# EAGLE design dallamcsengő (EAGLE 9.0.0)
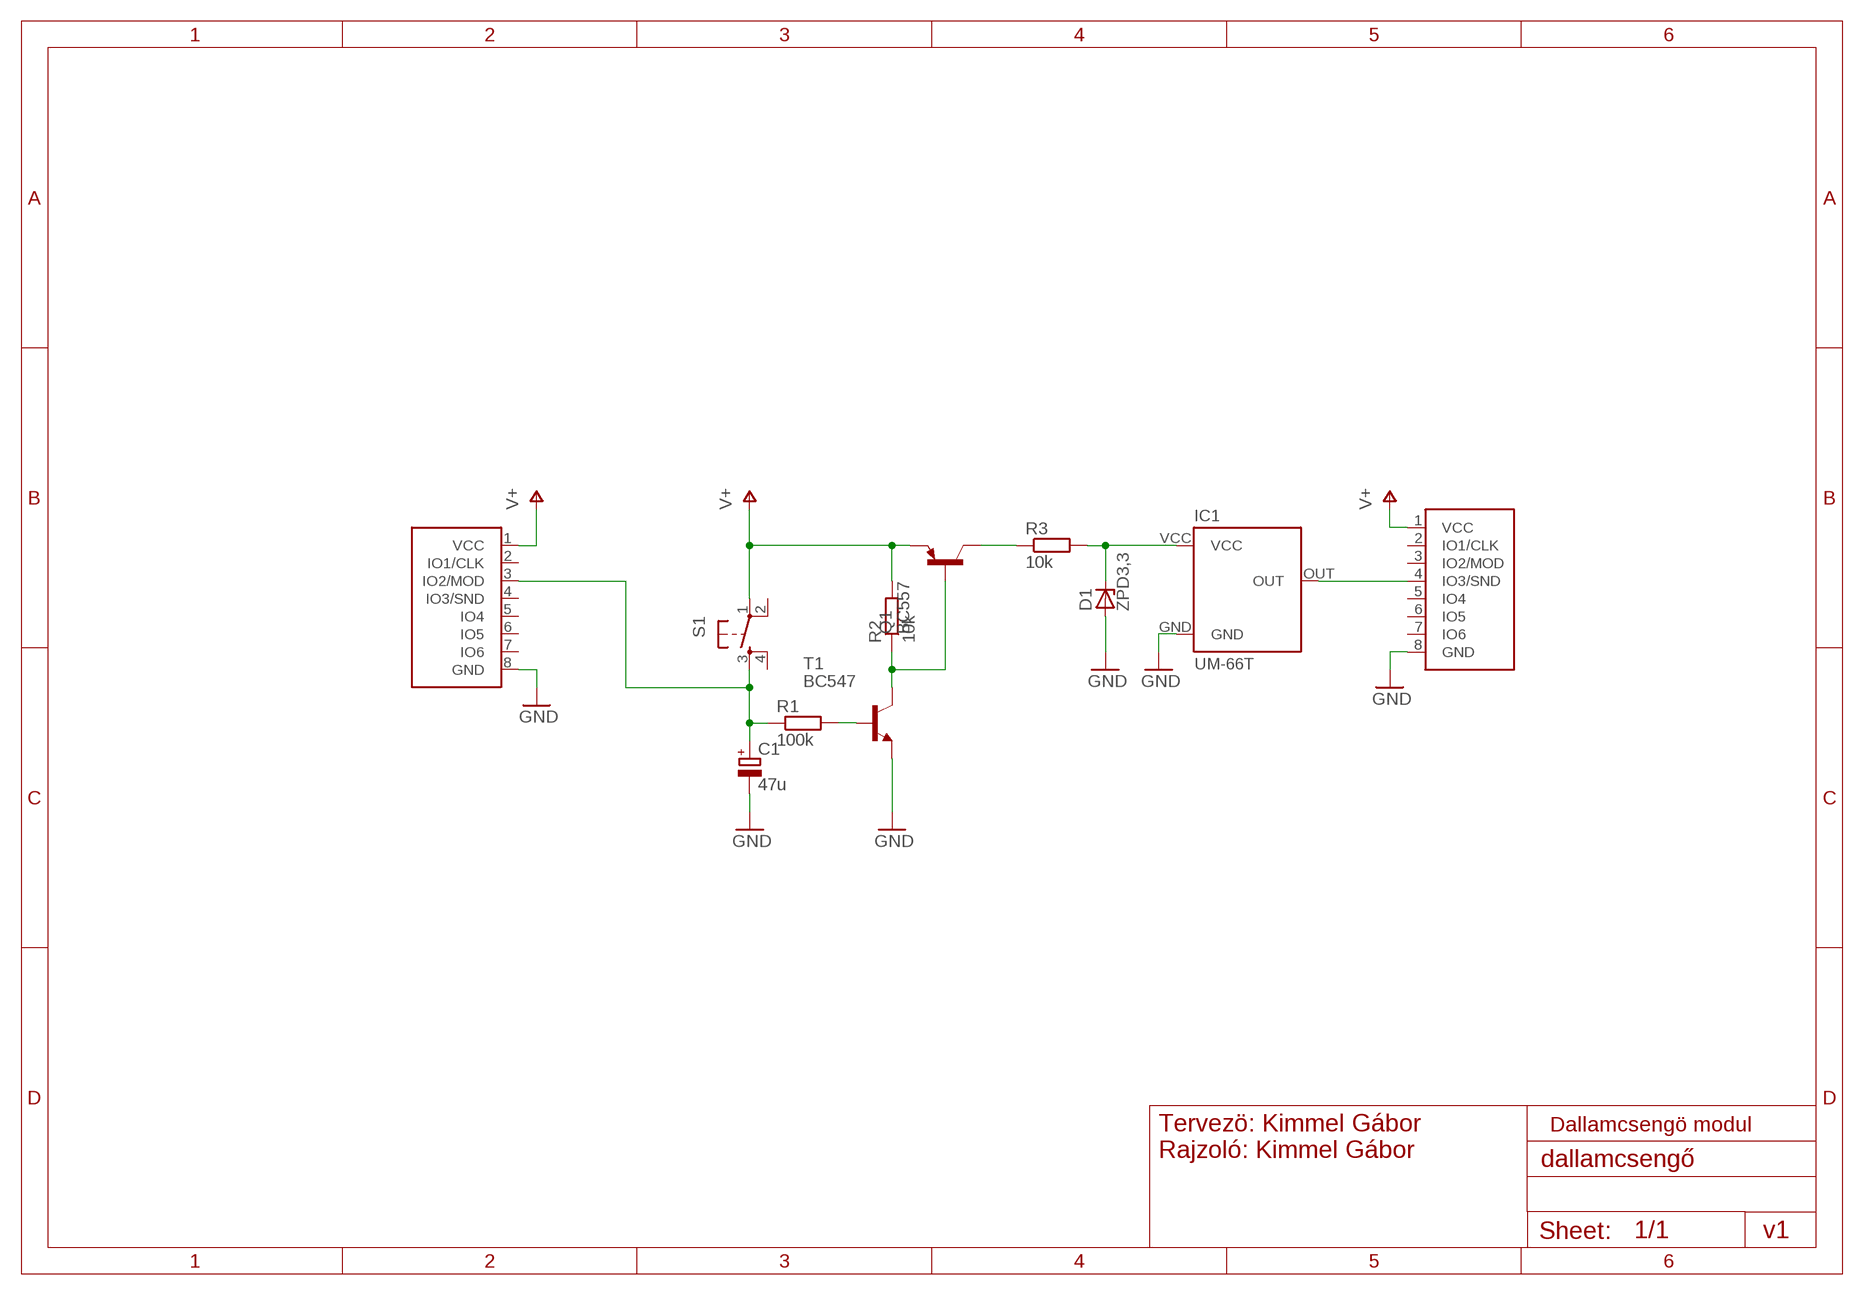
[diagram p0: schematic, sheet 1]

## Parts
C1  47u  CPOL-EUE5-8.5  [E5-8,5]
D1  ZPD3,3  ZENER-DIODEDO35Z10  [DO35Z10]
IC1  UM-66T  [TO92-DCS]
Q1  BC557  [TO92]
R1  100k  R-EU_0309/12  [0309/12]
R2  10k  R-EU_0309/12  [0309/12]
R3  10k  R-EU_0309/12  [0309/12]
S1  TAC_SWITCHPTH  [TACTILE-PTH]
T1  BC547  [TO92]
U$1  GANZ-CONNECTOR  [FE08W]
U$2  GANZ-CONNECTOR-OUT  [MA08-1W]

## Nets
GND: C1.- D1.A IC1.GND T1.1(E) U$1.8(GND) U$2.8(GND)
N$1: C1.+ R1.1 S1.3 U$1.3(IO2/MOD)
N$2: R1.2 T1.2(B)
N$3: Q1.2(B) R2.1 T1.3(C)
N$4: D1.C IC1.VCC R3.2
N$5: IC1.OUT U$2.4(IO3/SND)
N$6: Q1.3(C) R3.1
V+: Q1.1(E) R2.2 S1.1 U$1.1(VCC) U$2.1(VCC)
Unconnected: S1.2 S1.4 U$1.2(IO1/CLK) U$1.4(IO3/SND) U$1.5(IO4) U$1.6(IO5) U$1.7(IO6) U$2.2(IO1/CLK) U$2.3(IO2/MOD) U$2.5(IO4) U$2.6(IO5) U$2.7(IO6)

## Notes on the sheet
- Tervezö: Kimmel Gábor
  Rajzoló: Kimmel Gábor
- Dallamcsengö modul
- v1

## Library data of the parts
C1 = resistor:CPOL-EU: POLARIZED CAPACITOR, European symbol
D1 = diode:ZENER-DIODE: Z-Diode
IC1 = ganzlib:UM-66T
Q1 = transistor-pnp:BC557: PNP Transistor
R1-R3 = resistor:R-EU_: RESISTOR, European symbol
S1 = SparkFun-Electromechanical:TAC_SWITCH: Momentary Switch Button commonly used for reset or general input. Spark Fun Electronics SKU : COM-00097 SMT- SWCH-08247
T1 = transistor:BC547: NPN TRANSISTOR
U$1 = ganzlib:GANZ-CONNECTOR
U$2 = ganzlib:GANZ-CONNECTOR-OUT

## Board
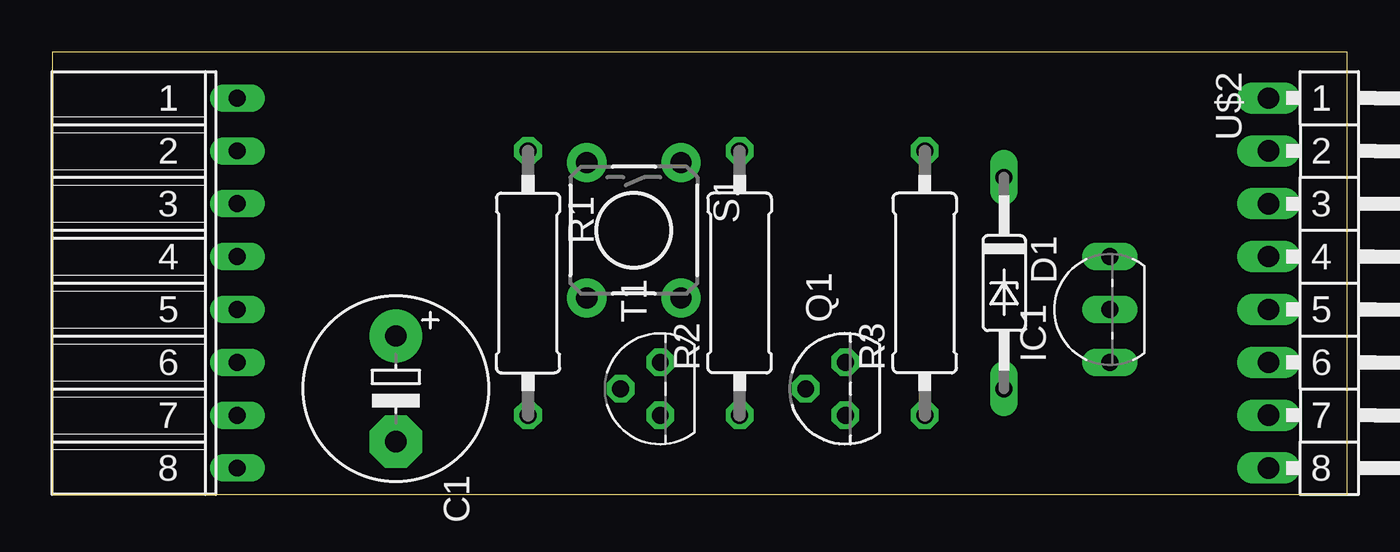
[diagram p1: board, top side]
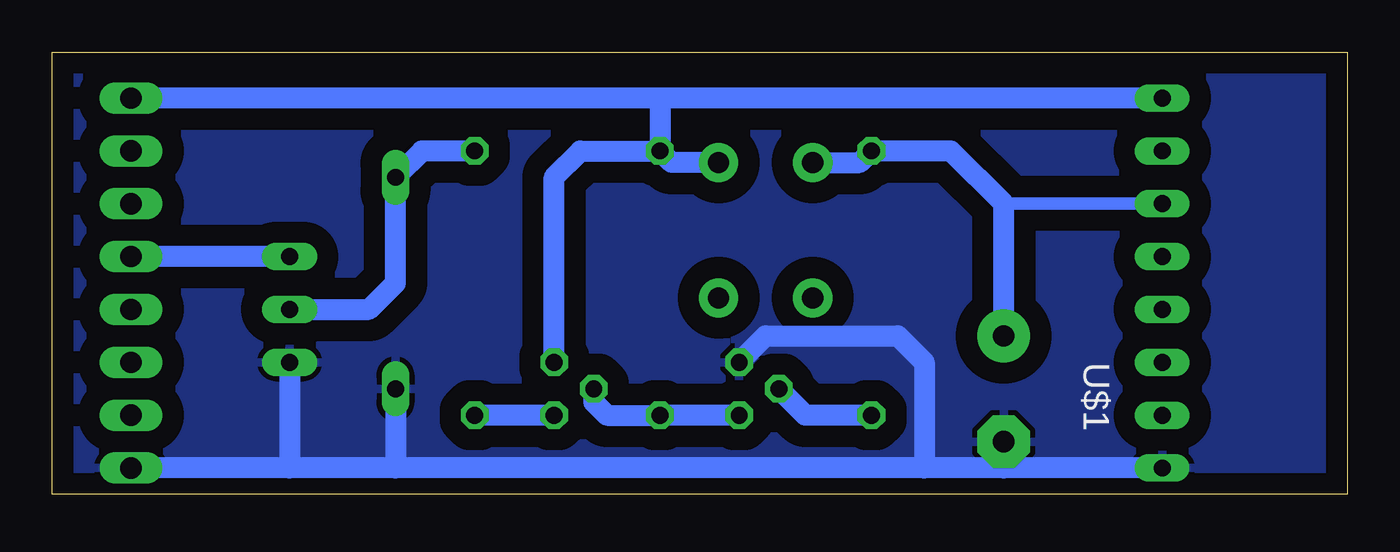
[diagram p2: board, bottom side, seen from below]

Size 62.21 x 21.26 mm. Coordinates in mm from the lower left corner, seen from the top.
Outline: 0,0 62.21,0 62.21,21.26 0,21.26 0,0
Copper layers (1*16): Top 0.035mm / dielectric 1.5mm / Bottom 0.035mm
Design rules "default *": minimum track width 10mil, minimum drill 24mil, track to track 8mil, track to pad 8mil, pad to pad 8mil, via to via 8mil, smd to smd 8mil, copper to edge 40mil, drill to drill 8mil, minimum pad ring 10mil, minimum via ring 8mil, stop-mask expansion 4mil, vias tented up to drill 0mil, thermal gap 10mil

### Footprints (pad centres in the part's own frame; a part is rotated, then mirrored left to right if it is on the bottom)
E5-8,5 = drill 1.016 pad 2.54: + -2.54,0 | drill 1.016 pad 2.54 octagon: - 2.54,0
DO35Z10 = drill 0.813 long: A 5.08,0; C -5.08,0
TO92-DCS = drill 0.813 long: GND -2.54,0; OUT 2.54,0; VCC 0,0
TO92 = drill 0.813 octagon: 1 1.27,0; 2 0,1.905; 3 -1.27,0
0309/12 = drill 0.813 octagon: 1 -6.35,0; 2 6.35,0
TACTILE-PTH = drill 1.016 pad 1.88: 1 -3.251,2.261; 2 3.251,2.261; 3 -3.251,-2.261; 4 3.251,-2.261
FE08W = drill 0.813 long: 1 5.08,8.89; 2 5.08,6.35; 3 5.08,3.81; 4 5.08,1.27; 5 5.08,-1.27; 6 5.08,-3.81; 7 5.08,-6.35; 8 5.08,-8.89
MA08-1W = drill 1.016 long: 1 0,8.89; 2 0,6.35; 3 0,3.81; 4 0,1.27; 5 0,-1.27; 6 0,-3.81; 7 0,-6.35; 8 0,-8.89

### Placement (x,y rotation side)
C1  16.51,5.08 270 top
D1  45.72,10.16 270 top
IC1  50.8,8.89 90 top
Q1  38.1,5.08 90 top
R1  22.86,10.16 270 top
R2  33.02,10.16 90 top
R3  41.91,10.16 90 top
S1  27.94,12.7 270 top
T1  29.21,5.08 90 top
U$1  3.81,10.16 0 top
U$2  58.42,10.16 0 top

### Tracks (layer width: path | path; a pad name or v marks a point on that pad's centre or on a via)
GND
  Bottom 1.016: U$1.8 16.51,1.27 | 16.51,1.27 20.32,1.27 | 20.32,1.27 45.72,1.27 | 45.72,1.27 50.8,1.27 | 50.8,1.27 U$2.8 | C1.- 16.51,1.27 | IC1.GND 50.8,1.27 | D1.A 45.72,1.27 | T1.1 27.94,7.62 21.59,7.62 20.32,6.35 20.32,1.27
  pour Bottom (isolate 1.016): 0,21.59 62.23,21.59 62.23,0 0,0
N$1
  Bottom 0.61: U$1.3 16.51,13.97
  Bottom 1.016: C1.+ 16.51,13.97 19.05,16.51 R1.1 23.42,15.95 S1.3
N$2
  Bottom 1.016: R1.2 26.04,3.81 T1.2
N$3
  Bottom 1.016: T1.3 R2.1 35.56,3.81 36.2,4.45 Q1.2
N$4
  Bottom 1.016: R3.2 44.45,16.51 D1.C 45.72,10.16 46.99,8.89 IC1.VCC
N$5
  Bottom 1.016: IC1.OUT U$2.4
N$6
  Bottom 1.016: Q1.3 R3.1
V+
  Bottom 1.016: 33.02,19.05 U$2.1 | Q1.1 38.1,15.24 36.83,16.51 R2.2 | S1.1 32.46,15.95 R2.2 | U$1.1 33.02,19.05 | 33.02,19.05 R2.2